# Altium schematic sheet Sheet1.SchDoc
size A4; SheetNumber: 1; SheetTotal: 1
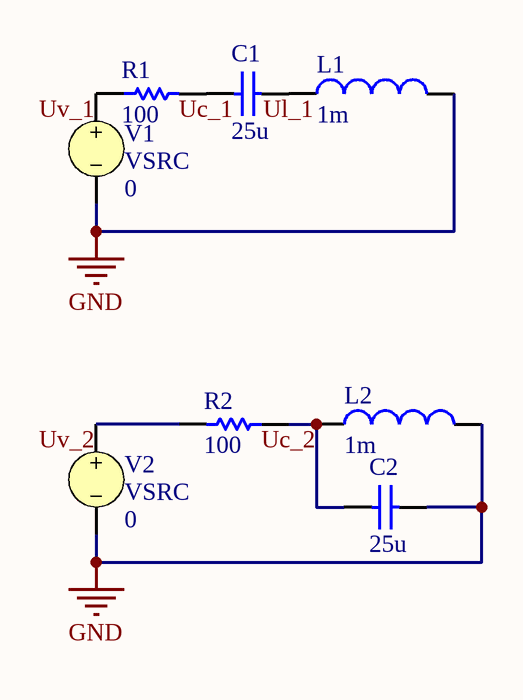
[diagram p0: Sheet1.SchDoc]

## Parts
C1  value 25u  (hidden comment: Capacitor)
C2  value 25u  (hidden comment: Capacitor)
L1  value 1m  (hidden comment: Inductor)
L2  value 1m  (hidden comment: Inductor)
R1  value 100  (hidden comment: Resistor)
R2  value 100  (hidden comment: Resistor)
V1  VSRC  DC Magnitude: 0
V2  VSRC  DC Magnitude: 0

## Nets
GND: C2.2 L1.2 L2.2 V1.2 V2.2
Uc_1: C1.2 R1.2
Uc_2: C2.1 L2.1 R2.1
Ul_1: C1.1 L1.1
Uv_1: R1.1 V1.1
Uv_2: R2.2 V2.1

## Library data of the parts
C1 C2 = Capacitor: SimulationGenericComponent: True
L1 L2 = Inductor: SimulationGenericComponent: True
R1 R2 = Resistor: TC1: 0; SimulationGenericComponent: True; TC2: 0
V1 V2 = VSRC: Voltage Source; Note: PCB Footprint - Not required; AC Magnitude: 1; Frequency: 1K; Published: 30-July-2020; LatestRevisionDate: 30-July-2020; LatestRevisionNote: Re-released for DXP Platform.; PackageReference: Not Applicable; Publisher: Altium Limited; AC Phase: 0; Offset: 0; Amplitude: 1; Delay: 0; Damping Factor: 0; Phase: 0